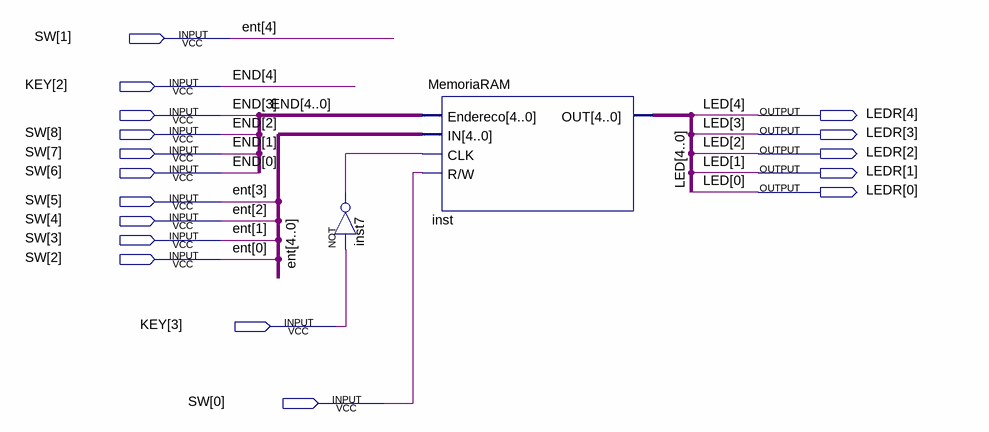
[diagram p0: schematic sheet]
// Quartus schematic Placa.bdf as structural Verilog: 2 symbols, 17 pins
module Placa (
  input  [8:0] SW,
  input  [3:2] KEY,
  output [4:0] LEDR
);

  wire inst7_out;
  wire [3:3] END;

  not inst7 (inst7_out, KEY[3]);
  MemoriaRAM inst (
    .Endereco({KEY[2], END[3], SW[8:6]}), .IN({SW[1], SW[5:2]}), .CLK(inst7_out), .\R/W (SW[0]), .OUT(LEDR));

  // Other names for the same wires on the sheet: END (some bits) = {KEY[2], SW[8:6]}; ent[4:0] = {SW[1], SW[5:2]};
  //   LED[4:0] = LEDR
endmodule
